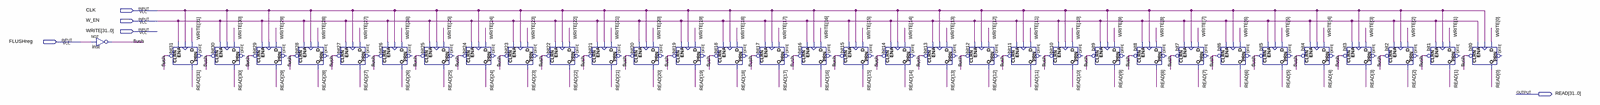
[diagram p0: schematic sheet, whole]
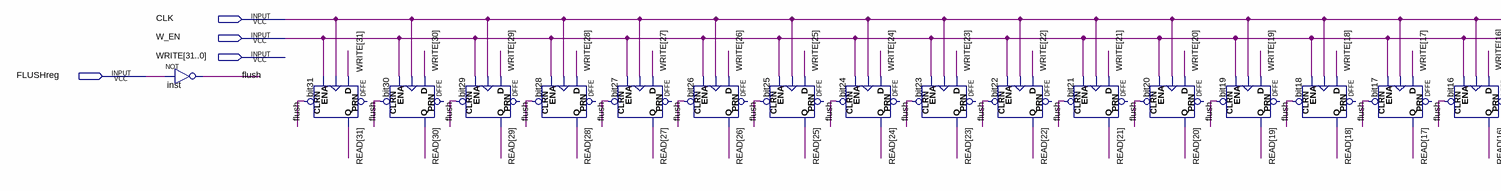
[diagram p1: schematic sheet, left part]
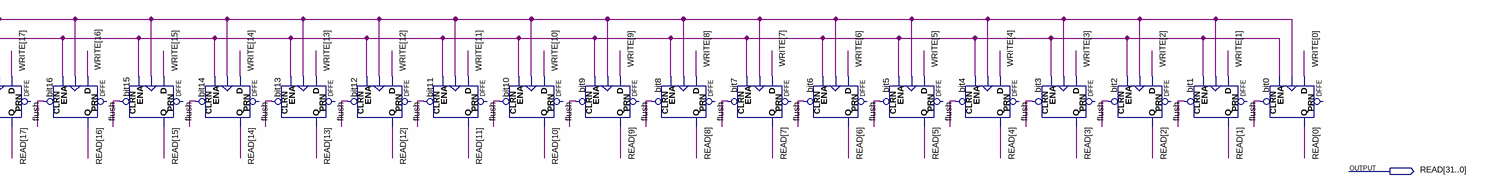
[diagram p2: schematic sheet, right part]
// Quartus schematic reg32.bdf as structural Verilog: 33 symbols, 5 pins
module reg32 (
  input  CLK,
  input  W_EN,
  input  [31:0] WRITE,
  input  FLUSHreg,
  output [31:0] READ
);

  wire flush;

  not inst (flush, FLUSHreg);
  DFFE bit31 (.CLRN(flush), .D(WRITE[31]), .CLK(CLK), .ENA(W_EN), .Q(READ[31]));  // open: PRN
  DFFE bit30 (.CLRN(flush), .D(WRITE[30]), .CLK(CLK), .ENA(W_EN), .Q(READ[30]));  // open: PRN
  DFFE bit29 (.CLRN(flush), .D(WRITE[29]), .CLK(CLK), .ENA(W_EN), .Q(READ[29]));  // open: PRN
  DFFE bit28 (.CLRN(flush), .D(WRITE[28]), .CLK(CLK), .ENA(W_EN), .Q(READ[28]));  // open: PRN
  DFFE bit27 (.CLRN(flush), .D(WRITE[27]), .CLK(CLK), .ENA(W_EN), .Q(READ[27]));  // open: PRN
  DFFE bit26 (.CLRN(flush), .D(WRITE[26]), .CLK(CLK), .ENA(W_EN), .Q(READ[26]));  // open: PRN
  DFFE bit25 (.CLRN(flush), .D(WRITE[25]), .CLK(CLK), .ENA(W_EN), .Q(READ[25]));  // open: PRN
  DFFE bit24 (.CLRN(flush), .D(WRITE[24]), .CLK(CLK), .ENA(W_EN), .Q(READ[24]));  // open: PRN
  DFFE bit23 (.CLRN(flush), .D(WRITE[23]), .CLK(CLK), .ENA(W_EN), .Q(READ[23]));  // open: PRN
  DFFE bit22 (.CLRN(flush), .D(WRITE[22]), .CLK(CLK), .ENA(W_EN), .Q(READ[22]));  // open: PRN
  DFFE bit21 (.CLRN(flush), .D(WRITE[21]), .CLK(CLK), .ENA(W_EN), .Q(READ[21]));  // open: PRN
  DFFE bit20 (.CLRN(flush), .D(WRITE[20]), .CLK(CLK), .ENA(W_EN), .Q(READ[20]));  // open: PRN
  DFFE bit19 (.CLRN(flush), .D(WRITE[19]), .CLK(CLK), .ENA(W_EN), .Q(READ[19]));  // open: PRN
  DFFE bit18 (.CLRN(flush), .D(WRITE[18]), .CLK(CLK), .ENA(W_EN), .Q(READ[18]));  // open: PRN
  DFFE bit17 (.CLRN(flush), .D(WRITE[17]), .CLK(CLK), .ENA(W_EN), .Q(READ[17]));  // open: PRN
  DFFE bit16 (.CLRN(flush), .D(WRITE[16]), .CLK(CLK), .ENA(W_EN), .Q(READ[16]));  // open: PRN
  DFFE bit15 (.CLRN(flush), .D(WRITE[15]), .CLK(CLK), .ENA(W_EN), .Q(READ[15]));  // open: PRN
  DFFE bit14 (.CLRN(flush), .D(WRITE[14]), .CLK(CLK), .ENA(W_EN), .Q(READ[14]));  // open: PRN
  DFFE bit13 (.CLRN(flush), .D(WRITE[13]), .CLK(CLK), .ENA(W_EN), .Q(READ[13]));  // open: PRN
  DFFE bit12 (.CLRN(flush), .D(WRITE[12]), .CLK(CLK), .ENA(W_EN), .Q(READ[12]));  // open: PRN
  DFFE bit11 (.CLRN(flush), .D(WRITE[11]), .CLK(CLK), .ENA(W_EN), .Q(READ[11]));  // open: PRN
  DFFE bit10 (.CLRN(flush), .D(WRITE[10]), .CLK(CLK), .ENA(W_EN), .Q(READ[10]));  // open: PRN
  DFFE bit9 (.CLRN(flush), .D(WRITE[9]), .CLK(CLK), .ENA(W_EN), .Q(READ[9]));  // open: PRN
  DFFE bit8 (.CLRN(flush), .D(WRITE[8]), .CLK(CLK), .ENA(W_EN), .Q(READ[8]));  // open: PRN
  DFFE bit7 (.CLRN(flush), .D(WRITE[7]), .CLK(CLK), .ENA(W_EN), .Q(READ[7]));  // open: PRN
  DFFE bit6 (.CLRN(flush), .D(WRITE[6]), .CLK(CLK), .ENA(W_EN), .Q(READ[6]));  // open: PRN
  DFFE bit5 (.CLRN(flush), .D(WRITE[5]), .CLK(CLK), .ENA(W_EN), .Q(READ[5]));  // open: PRN
  DFFE bit4 (.CLRN(flush), .D(WRITE[4]), .CLK(CLK), .ENA(W_EN), .Q(READ[4]));  // open: PRN
  DFFE bit3 (.CLRN(flush), .D(WRITE[3]), .CLK(CLK), .ENA(W_EN), .Q(READ[3]));  // open: PRN
  DFFE bit2 (.CLRN(flush), .D(WRITE[2]), .CLK(CLK), .ENA(W_EN), .Q(READ[2]));  // open: PRN
  DFFE bit1 (.CLRN(flush), .D(WRITE[1]), .CLK(CLK), .ENA(W_EN), .Q(READ[1]));  // open: PRN
  DFFE bit0 (.CLRN(flush), .D(WRITE[0]), .CLK(CLK), .ENA(W_EN), .Q(READ[0]));  // open: PRN
endmodule
